# Altium project ZQ_FOC_Lite.PrjPcb
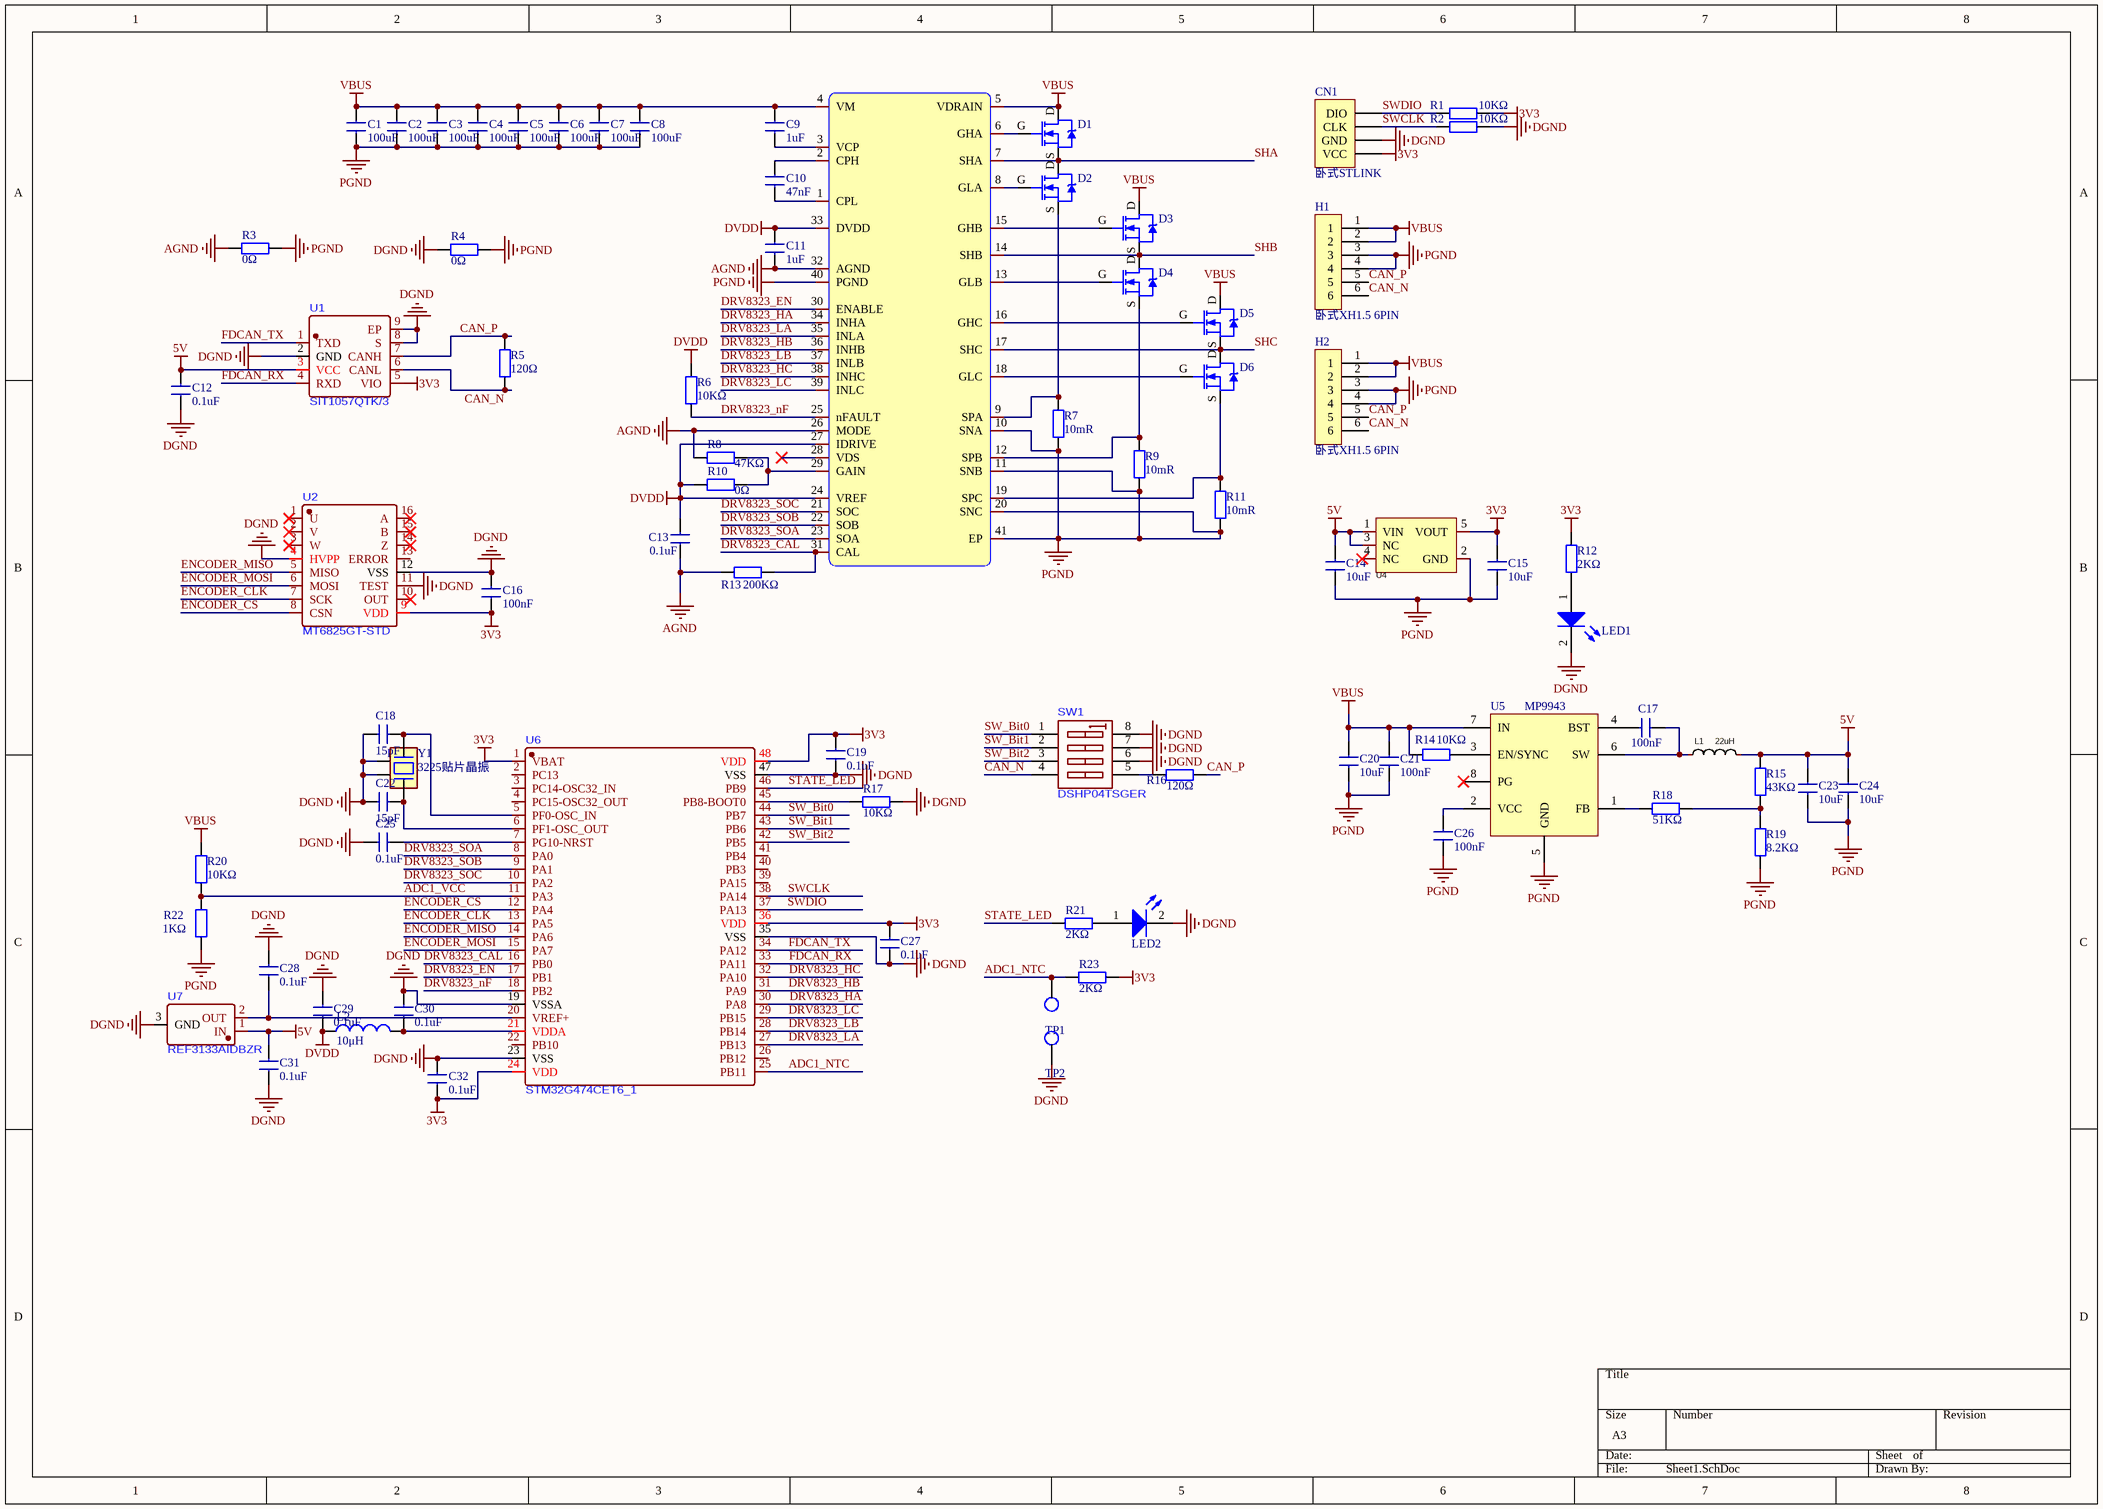
[diagram p0: Sheet1.SchDoc]
1 sheet, 79 parts. Net scope: global (net labels, ports and power ports of the same name join across sheets).
Board file: PCB1.PcbDoc

## Sheet Sheet1.SchDoc
size A3; SheetNumber: 1; SheetTotal: 1

### Parts
C1  100uF  [1206]
C2  100uF  [1206]
C3  100uF  [1206]
C4  100uF  [1206]
C5  100uF  [1206]
C6  100uF  [1206]
C7  100uF  [1206]
C8  100uF  [1206]
C9  1uF  [c0402]
C10  47nF  [c0402]
C11  1uF  [c0402]
C12  0.1uF  [c0402]
C13  0.1uF  [c0402]
C14  10uF  [c0402]
C15  10uF  [c0402]
C16  100nF  [C0402]
C17  100nF  [c0402]
C18  15pF  [c0402]
C19  0.1uF  [c0402]
C20  10uF  [C0603]
C21  100nF  [c0402]
C22  15pF  [c0402]
C23  10uF  [C0603]
C24  10uF  [C0603]
C25  0.1uF  [c0402]
C26  100nF  [c0402]
C27  0.1uF  [c0402]
C28  0.1uF  [c0402]
C29  0.1uF  [c0402]
C30  0.1uF  [c0402]
C31  0.1uF  [c0402]
C32  0.1uF  [c0402]
CN1  卧式STLINK  [CONN-SMD_4P-P1.25_GH1.25-4P]
D1  NTMFS5C410NL  [DFN-8_L3.0-W3.0-P0.65-BL]  (value not drawn)
D2  NTMFS5C410NL  [DFN-8_L3.0-W3.0-P0.65-BL]  (value not drawn)
D3  NTMFS5C410NL  [DFN-8_L3.0-W3.0-P0.65-BL]  (value not drawn)
D4  NTMFS5C410NL  [DFN-8_L3.0-W3.0-P0.65-BL]  (value not drawn)
D5  NTMFS5C410NL  [DFN-8_L3.0-W3.0-P0.65-BL]  (value not drawn)
D6  NTMFS5C410NL  [DFN-8_L3.0-W3.0-P0.65-BL]  (value not drawn)
H1  卧式XH1.5 6PIN  [CONN-SMD_6P-P1.50_ZX-ZH1.5-6PWT]
H2  卧式XH1.5 6PIN  [CONN-SMD_6P-P1.50_ZX-ZH1.5-6PWT]
L1  22uH  [IND-SMD_L2.5-W2.0]
L2  10μH  [L0805]
LED1  LED  [led0805]  (value not drawn)
LED2  LED  [led0805]  (value not drawn)
R1  10KΩ  [R0402]
R2  10KΩ  [R0402]
R3  0Ω  [R0402]
R4  0Ω  [R0402]
R5  120Ω  [R0402]
R6  10KΩ  [R0402]
R7  10mR  [1206]
R8  47KΩ  [R0402]
R9  10mR  [1206]
R10  0Ω  [R0402]
R11  10mR  [1206]
R12  2KΩ  [R0402]
R13  200KΩ  [R0402]
R14  10KΩ  [R0402]
R15  43KΩ  [R0402]
R16  120Ω  [R0402]
R17  10KΩ  [R0402]
R18  51KΩ  [R0402]
R19  8.2KΩ  [R0402]
R20  10KΩ  [R0402]
R21  2KΩ  [R0402]
R22  1KΩ  [R0402]
R23  2KΩ  [R0402]
SW1  DSHP04TSGER  [SW-SMD_8P-L6.7-W5.4-P1.27-LS8.4]
TP1  testpoint  [testpoint]  (value not drawn)
TP2  testpoint  [testpoint]  (value not drawn)
U1  SIT1057QTK/3  [DFN-8_L3.0-W3.0-P0.65-BL-EP]
U2  MT6825GT-STD  [TSSOP-16_L5.0-W4.4-P0.65-LS6.4-BL-1]
U3  DRV8323HRTAR  [QFN-40_L6.0-W6.0-P0.50-BL-EP4.5]  (value not drawn)
U4  XC6201P332MR-HXY  [SOT-23-5_L3.0-W1.7-P0.95-LS2.8-BR]  (value not drawn)
U5  MP9943  [QFN-8 3x3]
U6  STM32G474CET6_1  [LQFP-48_L7.0-W7.0-P0.50-LS9.0-BL]
U7  REF3133AIDBZR  [SOT-23-3_L2.9-W1.3-P1.90-LS2.4-BR]
Y1  3225贴片晶振  [OSC-3225-4P]

### Nets
3V3: C15.2 C16.1 C19.1 C27.1 C32.2 CN1.1(VCC) R1.2 R12.1 R23.2 U1.5(VIO) U2.9(VDD) U4.5(VOUT) U6.1(VBAT) U6.24(VDD) U6.36(VDD) U6.48(VDD)
5V: C12.2 C14.2 C23.2 C24.2 C31.1 L1.2 R15.2 U1.3(VCC) U4.1(VIN) U4.3(NC) U7.1(IN)
AGND: C11.1 C13.1 R3.1 R8.1 R13.2 U3.26(MODE) U3.32(AGND)
DGND: C12.1 C16.2 C18.2 C19.2 C22.2 C25.2 C27.2 C28.2 C29.1 C30.1 C31.2 C32.1 CN1.2(GND) LED1.2(K) LED2.2(K) R2.2 R4.1 R17.2 SW1.6(B3) SW1.7(B2) SW1.8(B1) TP2.1 U1.2(GND) U1.8(S) U1.9(EP) U2.4(HVPP) U2.11(TEST) U2.12(VSS) U6.19(VSSA) U6.23(VSS) U6.35(VSS) U6.47(VSS) U7.3(GND) Y1.2 Y1.4
DVDD: C11.2 C13.2 C29.2 L2.1 R6.1 R10.1 U3.24(VREF) U3.27(IDRIVE) U3.33(DVDD)
PGND: C1.1 C2.1 C3.1 C4.1 C5.1 C6.1 C7.1 C8.1 C14.1 C15.1 C20.1 C21.1 C23.1 C24.1 C26.1 H1.3 H1.4 H2.3 H2.4 R3.2 R4.2 R7.1 R9.1 R11.1 R19.1 R22.2 U3.10(SNA) U3.11(SNB) U3.20(SNC) U3.40(PGND) U3.41(EP) U4.2(GND) U5.5(GND)
VBUS: C1.2 C2.2 C3.2 C4.2 C5.2 C6.2 C7.2 C8.2 C9.2 C20.2 C21.2 D1.D D3.D D5.D H1.1 H1.2 H2.1 H2.2 R14.1 R20.2 U3.4(VM) U3.5(VDRAIN) U5.7(IN)
ADC1_NTC: R23.1 TP1.1 U6.25(PB11)
ADC1_VCC: R20.1 R22.1 U6.11(PA3)
CAN_N: H1.6 H2.6 R5.2 SW1.4(A4) U1.6(CANL)
CAN_P: H1.5 H2.5 R5.1 R16.1 U1.7(CANH)
DRV8323_CAL: R13.1 U3.31(CAL) U6.16(PB0)
DRV8323_EN: U3.30(ENABLE) U6.17(PB1)
DRV8323_HA: U3.34(INHA) U6.30(PA8)
DRV8323_HB: U3.36(INHB) U6.31(PA9)
DRV8323_HC: U3.38(INHC) U6.32(PA10)
DRV8323_LA: U3.35(INLA) U6.27(PB13)
DRV8323_LB: U3.37(INLB) U6.28(PB14)
DRV8323_LC: U3.39(INLC) U6.29(PB15)
DRV8323_nF: R6.2 U3.25(nFAULT) U6.18(PB2)
DRV8323_SOA: U3.23(SOA) U6.8(PA0)
DRV8323_SOB: U3.22(SOB) U6.9(PA1)
DRV8323_SOC: U3.21(SOC) U6.10(PA2)
ENCODER_CLK: U2.7(SCK) U6.13(PA5)
ENCODER_CS: U2.8(CSN) U6.12(PA4)
ENCODER_MISO: U2.5(MISO) U6.14(PA6)
ENCODER_MOSI: U2.6(MOSI) U6.15(PA7)
FDCAN_RX: U1.4(RXD) U6.33(PA11)
FDCAN_TX: U1.1(TXD) U6.34(PA12)
SHA: D1.S D2.D U3.7(SHA)
SHB: D3.S D4.D U3.14(SHB)
SHC: D5.S D6.D U3.17(SHC)
STATE_LED: R21.1 U6.46(PB9)
SW_Bit0: SW1.1(A1) U6.44(PB7)
SW_Bit1: SW1.2(A2) U6.43(PB6)
SW_Bit2: SW1.3(A3) U6.42(PB5)
SWCLK: CN1.3(CLK) R2.1 U6.38(PA14)
SWDIO: CN1.4(DIO) R1.1 U6.37(PA13)
NetC9_1: C9.1 U3.3(VCP)
NetC10_1: C10.1 U3.1(CPL)
NetC10_2: C10.2 U3.2(CPH)
NetC17_1: C17.1 U5.4(BST)
NetC17_2: C17.2 L1.1 U5.6(SW)
NetC18_1: C18.1 U6.5(PF0-OSC_IN) Y1.3
NetC22_1: C22.1 U6.6(PF1-OSC_OUT) Y1.1
NetC25_1: C25.1 U6.7(PG10-NRST)
NetC26_2: C26.2 U5.2(VCC)
NetC28_1: C28.1 U6.20(VREF+) U7.2(OUT)
NetC30_2: C30.2 L2.2 U6.21(VDDA)
NetD1_G: D1.G U3.6(GHA)
NetD2_G: D2.G U3.8(GLA)
NetD2_S: D2.S R7.2 U3.9(SPA)
NetD3_G: D3.G U3.15(GHB)
NetD4_G: D4.G U3.13(GLB)
NetD4_S: D4.S R9.2 U3.12(SPB)
NetD5_G: D5.G U3.16(GHC)
NetD6_G: D6.G U3.18(GLC)
NetD6_S: D6.S R11.2 U3.19(SPC)
NetLED1_1: LED1.1(A) R12.2
NetLED2_1: LED2.1(A) R21.2
NetR8_2: R8.2 R10.2 U3.29(GAIN)
NetR14_2: R14.2 U5.3(EN/SYNC)
NetR15_1: R15.1 R18.2 R19.2
NetR16_2: R16.2 SW1.5(B4)
NetR17_1: R17.1 U6.45(PB8-BOOT0)
NetR18_1: R18.1 U5.1(FB)

Not connected (* = marked no-connect by the designer): U2 1(U)* 2(V)* 3(W)* 10(OUT)* 13(ERROR) 14(Z)* 15(B)* 16(A)*; U3 28(VDS)*; U4 4(NC)*; U5 8(PG)*; U6 2(PC13) 3(PC14-OSC32_IN) 4(PC15-OSC32_OUT) 22(PB10) 26(PB12) 39(PA15) 40(PB3) 41(PB4)

### Library data of the parts
C1-C8 C20 C23 C24 = 1210贴片电容
C9-C19 C21 C22 C25-C32 = 0402贴片电容: 贴片电容0402
D1-D6 = NTMFS5C410NL: N沟道MOS管; Note: Pin 2 is electrically connected to pin 4.; Published: 8-Jun-2000; LatestRevisionDate: 17-Jul-2002; LatestRevisionNote: Re-released for DXP Platform.; DatasheetVersion: PD-9.814; PackageVersion: Feb-1997; PackageReference: TO-220AB; Publisher: Altium Limited; PackageDescription: TO, Thru-Hole, Vertical, Heatsink Mounted; 3 In-Line Leads; Pitch 2.54 mm; ComponentLink1Description: Manufacturer Link; ComponentLink1URL: http://www.irf.com/
L1 = 0530屏蔽电感: 一体成型屏蔽电感，0530封装，额定电流3A; Manufacturer: XR(祥如); Symbol: XR0530-100M; Add into BOM: yes; Value: 10uH; Tolerance: ±20%; Rated Current: 3.2A; Saturation Current (Isat): 3.5A; DC Resistance (DCR): 125mΩ; Type: 一体成型电感; Device: XR0530-100M; LCSC Part Name: 10uH ±20% 3.5A; Supplier Part: C5307602; Manufacturer Part: XR0530-100M; Supplier Footprint: SMD,0530; JLCPCB Part Class: Extended Part; Datasheet: https://atta.szlcsc.com/upload/public/pdf/source/20240328/42FE63A3232C4AF7EB8F1CDEDD5FC69F.pdf; Supplier: LCSC; Convert to PCB: yes
L2 = 0805贴片电感
LED1 LED2 = 0805贴片LED
R1-R6 R8 R10 R12-R23 = 0402贴片电阻: W: *
R7 R9 R11 = 2512检流电阻
U2 = MT6825GT-STD: 18位绝对角编码器
U3 = DRV8323HRTAR: Manufacturer: TI(德州仪器); Add into BOM: yes; Symbol: DRV8323HRTAR; Device: DRV8323HRTAR; LCSC Part Name: 5mA 无刷直流BLDC电机驱动芯片 60V; Supplier Part: C701783; Manufacturer Part: DRV8323HRTAR; Supplier Footprint: QFN-40-EP(6x6); JLCPCB Part Class: Extended Part; Datasheet: https://www.ti.com/cn/lit/gpn/drv8323; Supplier: LCSC; Convert to PCB: yes
U4 = XC6201P332MR-HXY: 3.3V LDO; Manufacturer: HXY MOSFET(华轩阳电子); Add into BOM: yes; Output Type: 固定; Maximum Input Voltage: 12V; MAX Output Current: 300mA; Output Polarity: 正极; Symbol: XC6201P332MR-HXY; Device: XC6201P332MR-HXY; LCSC Part Name: XC6201P332MR-HXY; Supplier Part: C19626990; Manufacturer Part: XC6201P332MR-HXY; Supplier Footprint: SOT-23-5L; JLCPCB Part Class: Extended Part; Datasheet: https://atta.szlcsc.com/upload/public/pdf/source/20231208/3D7EFECB06481ED5AED4680614D7FFF5.pdf; Supplier: LCSC; Convert to PCB: yes; Output Voltage: 3.3V
Y1 = 3225贴片晶振: Value: 16M